# Altium schematic sheet [1]-Block Diagram.SchDoc
size A2
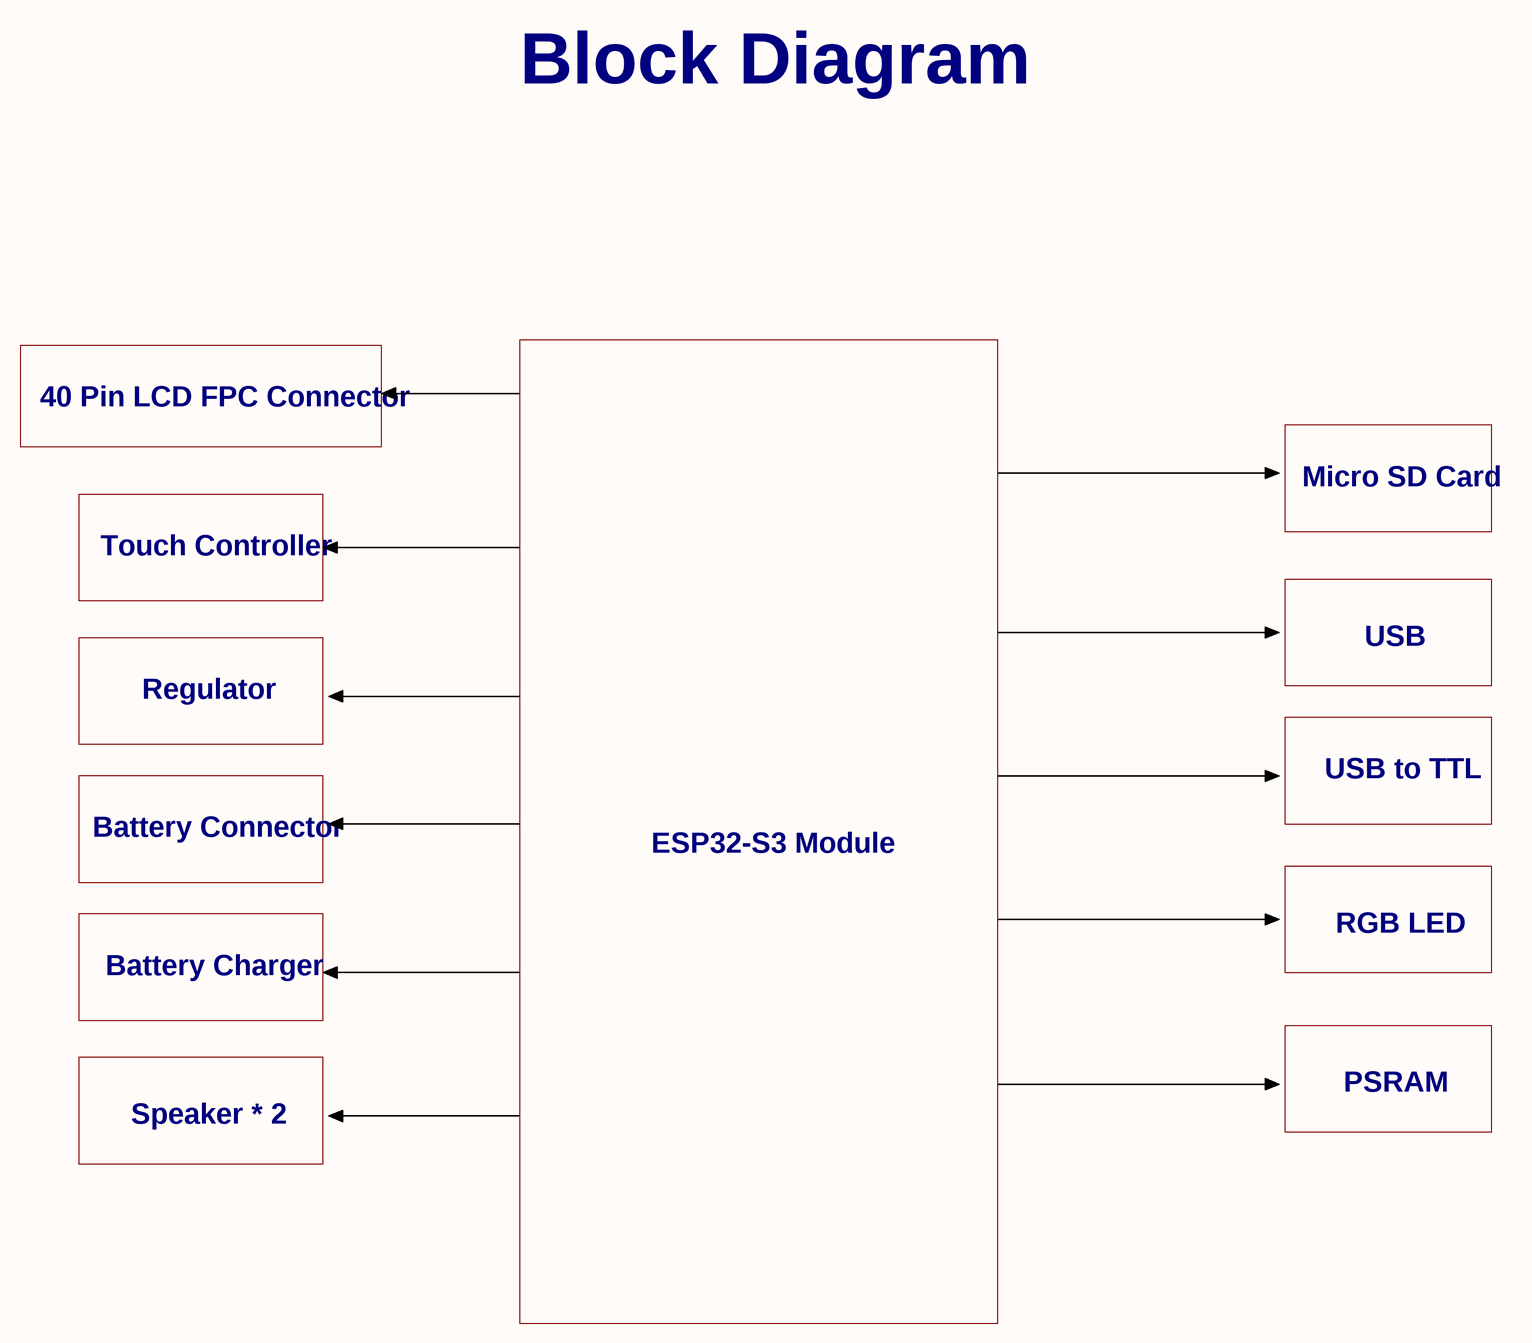
[diagram p0: [1]-Block Diagram.SchDoc]

## Notes on the sheet
- Block Diagram
- 40 Pin LCD FPC Connector
- Micro SD Card
- Touch Controller
- Regulator
- USB
- Battery Connector
- USB to TTL
- ESP32-S3 Module
- RGB LED
- Battery Charger
- PSRAM
- Speaker * 2